# Altium schematic sheet Wifi-Bluetooth-Logic.SchDoc
size B; SheetNumber: 10; SheetTotal: 14
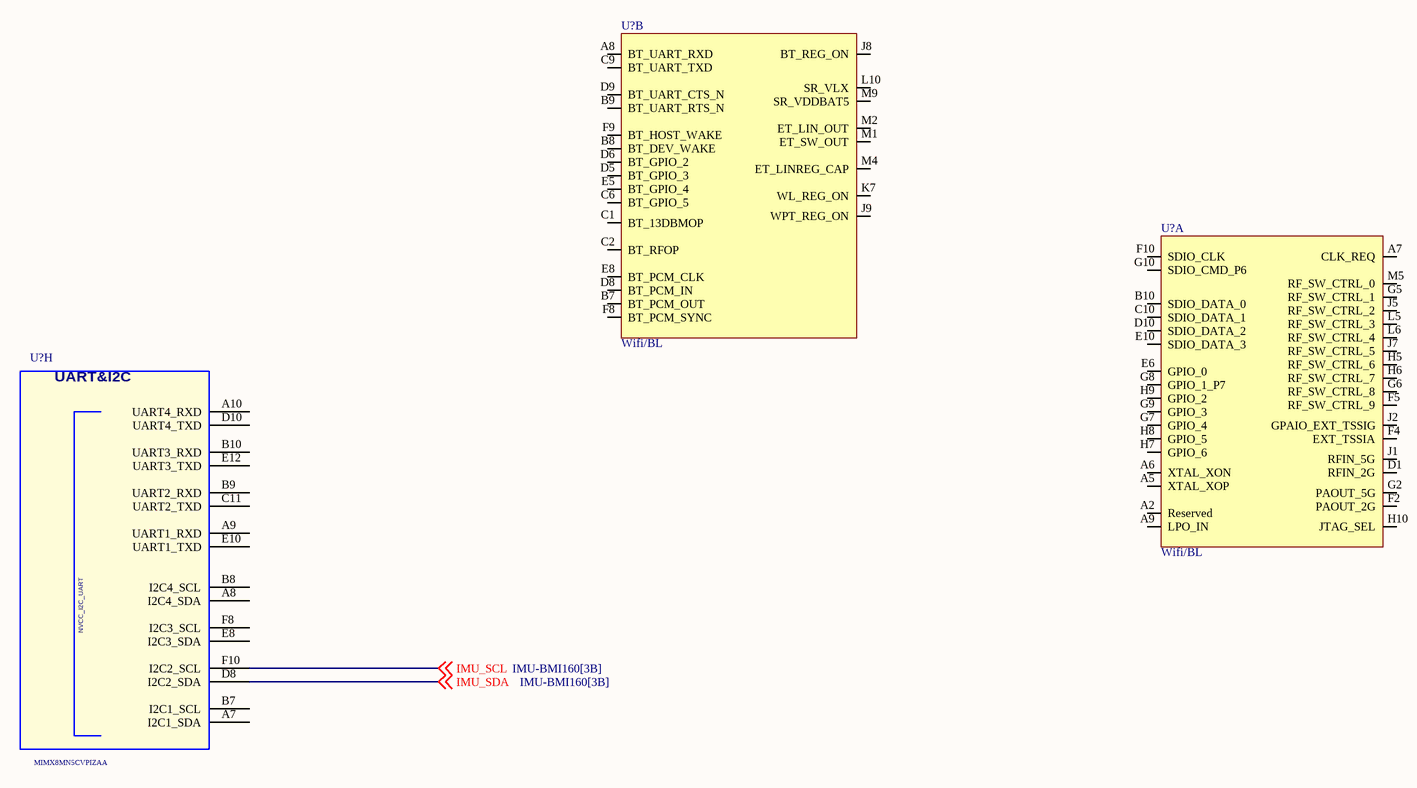
[diagram p0: Wifi-Bluetooth-Logic.SchDoc]

## Parts
(Parts that share a designator on the sheet are numbered #1, #2 ... from top to bottom, then left to right.)
U?#1  Wifi/BL  [106 BALL WLBGA 3.76X4.43X0.53 MM]  (part B of 3)
U?#2  Wifi/BL  [106 BALL WLBGA 3.76X4.43X0.53 MM]  (part A of 3)
U?#3  MIMX8MN5CVPIZAA  [BGA306C50P21X21_1100X1100X101]  (part H of 12)

## Nets
IMU_SCL: U?#3.F10(I2C2_SCL) ; off-sheet IMU_SCL
IMU_SDA: U?#3.D8(I2C2_SDA) ; off-sheet IMU_SDA

Not connected (* = marked no-connect by the designer): U?#1 A8(BT_UART_RXD) B7(BT_PCM_OUT) B8(BT_DEV_WAKE) B9(BT_UART_RTS_N) C1(BT_13DBMOP) C2(BT_RFOP) C6(BT_GPIO_5) C9(BT_UART_TXD) D5(BT_GPIO_3) D6(BT_GPIO_2) D8(BT_PCM_IN) D9(BT_UART_CTS_N) E5(BT_GPIO_4) E8(BT_PCM_CLK) F8(BT_PCM_SYNC) F9(BT_HOST_WAKE) J8(BT_REG_ON) J9(WPT_REG_ON) K7(WL_REG_ON) L10(SR_VLX) M1(ET_SW_OUT) M2(ET_LIN_OUT) M4(ET_LINREG_CAP) M9(SR_VDDBAT5); U?#2 A2(Reserved) A5(XTAL_XOP) A6(XTAL_XON) A7(CLK_REQ) A9(LPO_IN) B10(SDIO_DATA_0) C10(SDIO_DATA_1) D1(RFIN_2G) D10(SDIO_DATA_2) E6(GPIO_0) E10(SDIO_DATA_3) F2(PAOUT_2G) F4(EXT_TSSIA) F5(RF_SW_CTRL_9) F10(SDIO_CLK) G2(PAOUT_5G) G5(RF_SW_CTRL_1) G6(RF_SW_CTRL_8) G7(GPIO_4) G8(GPIO_1_P7) G9(GPIO_3) G10(SDIO_CMD_P6) H5(RF_SW_CTRL_6) H6(RF_SW_CTRL_7) H7(GPIO_6) H8(GPIO_5) H9(GPIO_2) H10(JTAG_SEL) J1(RFIN_5G) J2(GPAIO_EXT_TSSIG) J5(RF_SW_CTRL_2) J7(RF_SW_CTRL_5) L5(RF_SW_CTRL_3) L6(RF_SW_CTRL_4) M5(RF_SW_CTRL_0); U?#3 A7(I2C1_SDA) A8(I2C4_SDA) A9(UART1_RXD) A10(UART4_RXD) B7(I2C1_SCL) B8(I2C4_SCL) B9(UART2_RXD) B10(UART3_RXD) C11(UART2_TXD) D10(UART4_TXD) E8(I2C3_SDA) E10(UART1_TXD) E12(UART3_TXD) F8(I2C3_SCL)

## Notes on the sheet
- (in symbol MIMX8MN, part H) UART&I2C

## Library data of the parts
U?#1 U?#2 = CYW43012
U?#3 = MIMX8MN: IC CPU QUAD CORTEX A53+M7 1.4GHZ -- BGA306; PCB Footprint: pbga306_0p5_sq11mm; AGILE_PN: TMP-CIP-5098; CAD_APPROVED: Yes; PRE_APN: 330-77152; Temp Range: -40¡ãC to 105¡ãC; MFG_NAME01: NXP SEMICONDUCTORS; CLASS: IC; HEIGHT: 1.01MM; ROHS: Yes; MFG_PN01: MIMX8MN5CVPIZAA